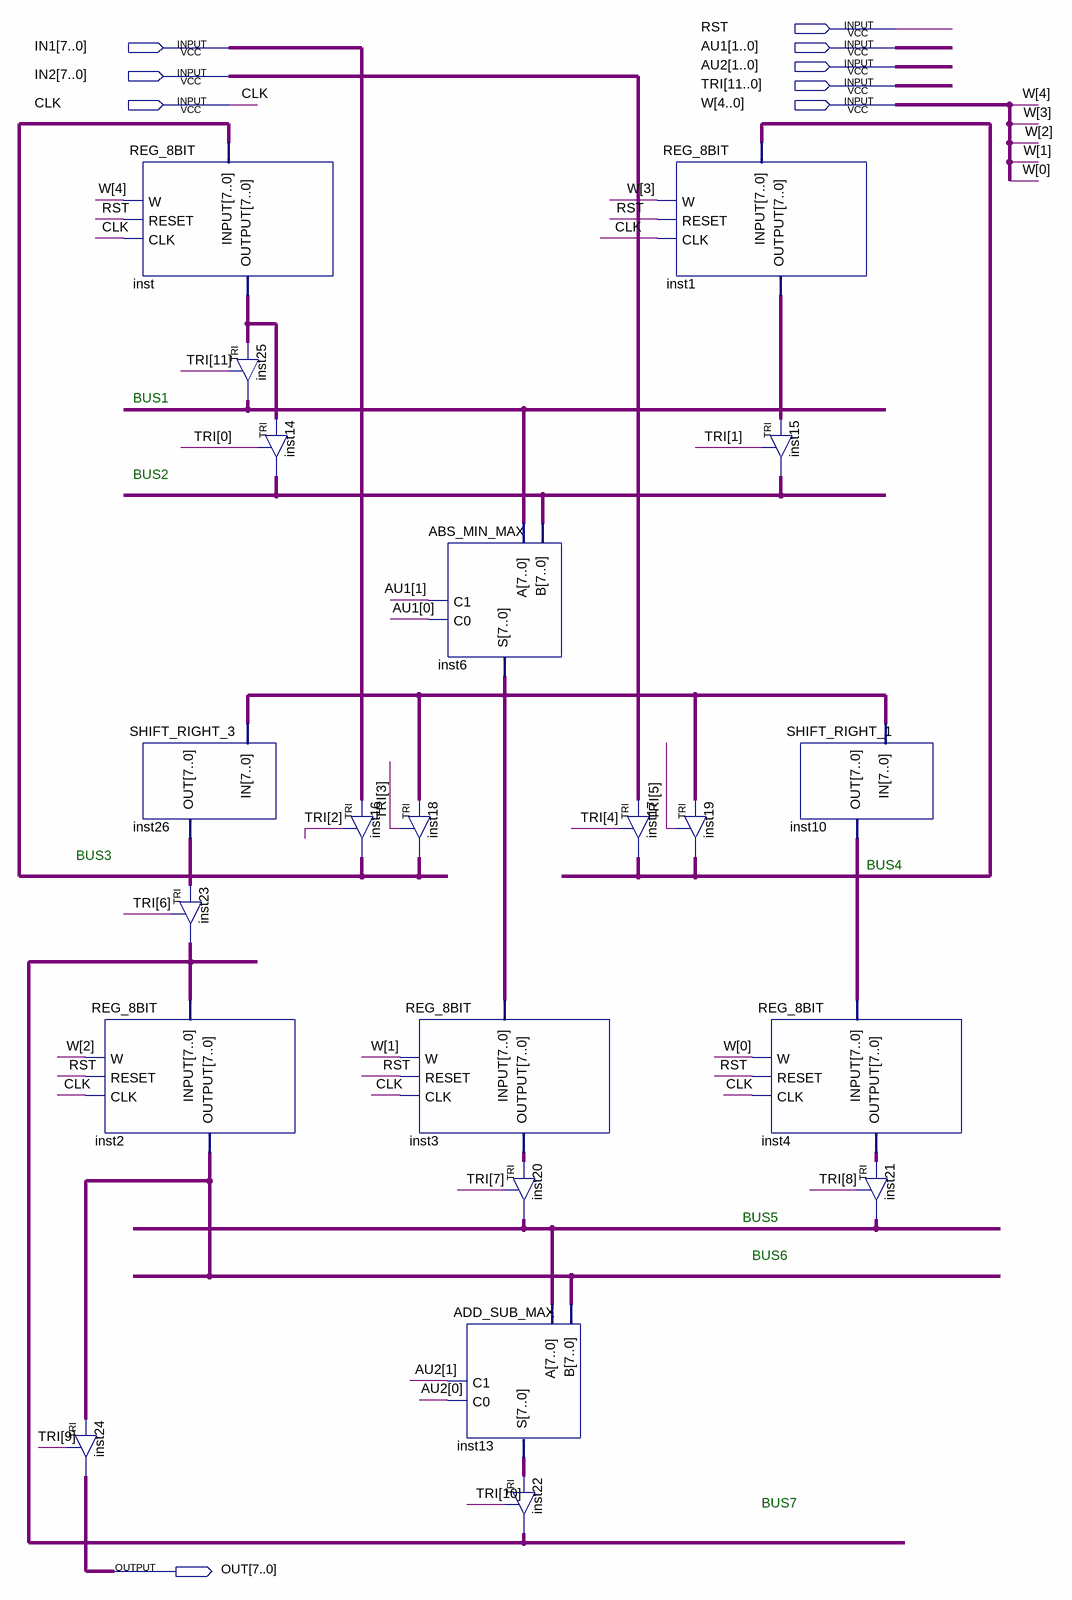
[diagram p0: schematic sheet]
// Quartus schematic DATAPATH.bdf as structural Verilog: 21 symbols, 9 pins
module DATAPATH (
  input  RST,
  input  [7:0] IN1,
  input  [1:0] AU1,
  input  [1:0] AU2,
  input  [7:0] IN2,
  input  [11:0] TRI,
  input  CLK,
  input  [4:0] W,
  output [7:0] OUT
);

  wire [7:0] inst1_output, inst2_output, inst3_output, inst4_output, inst6_s, inst10_out, inst13_s,
       inst14_out, inst16_out, inst17_out, inst20_out, inst23_out, inst25_out, inst26_out, inst_output;

  REG_8BIT inst2 (.W(W[2]), .INPUT(inst23_out), .RESET(RST), .CLK(CLK), .OUTPUT(inst2_output));
  TRI inst24[7:0] (.IN(inst2_output), .OE(TRI[9]), .OUT(OUT));
  REG_8BIT inst (.W(W[4]), .INPUT(inst16_out), .RESET(RST), .CLK(CLK), .OUTPUT(inst_output));
  SHIFT_RIGHT_3 inst26 (.IN(inst6_s), .OUT(inst26_out));
  TRI inst23[7:0] (.IN(inst26_out), .OE(TRI[6]), .OUT(inst23_out));
  TRI inst25[7:0] (.IN(inst_output), .OE(TRI[11]), .OUT(inst25_out));
  TRI inst14[7:0] (.IN(inst_output), .OE(TRI[0]), .OUT(inst14_out));
  TRI inst16[7:0] (.IN(IN1), .OE(TRI[2]), .OUT(inst16_out));
  TRI inst18[7:0] (.IN(inst6_s), .OE(TRI[3]), .OUT(inst16_out));
  REG_8BIT inst3 (.W(W[1]), .INPUT(inst6_s), .RESET(RST), .CLK(CLK), .OUTPUT(inst3_output));
  ABS_MIN_MAX inst6 (.A(inst25_out), .B(inst14_out), .C1(AU1[1]), .C0(AU1[0]), .S(inst6_s));
  ADD_SUB_MAX inst13 (.A(inst20_out), .B(inst2_output), .C1(AU2[1]), .C0(AU2[0]), .S(inst13_s));
  TRI inst20[7:0] (.IN(inst3_output), .OE(TRI[7]), .OUT(inst20_out));
  TRI inst22[7:0] (.IN(inst13_s), .OE(TRI[10]), .OUT(inst23_out));
  TRI inst17[7:0] (.IN(IN2), .OE(TRI[4]), .OUT(inst17_out));
  REG_8BIT inst1 (.W(W[3]), .INPUT(inst17_out), .RESET(RST), .CLK(CLK), .OUTPUT(inst1_output));
  TRI inst19[7:0] (.IN(inst6_s), .OE(TRI[5]), .OUT(inst17_out));
  TRI inst15[7:0] (.IN(inst1_output), .OE(TRI[1]), .OUT(inst14_out));
  SHIFT_RIGHT_1 inst10 (.IN(inst6_s), .OUT(inst10_out));
  REG_8BIT inst4 (.W(W[0]), .INPUT(inst10_out), .RESET(RST), .CLK(CLK), .OUTPUT(inst4_output));
  TRI inst21[7:0] (.IN(inst4_output), .OE(TRI[8]), .OUT(inst20_out));

  // Notes on the sheet:
  //   BUS1
  //   BUS2
  //   BUS3
  //   BUS4
  //   BUS5
  //   BUS6
  //   BUS7
endmodule
